# EAGLE schematic MPB-03a (EAGLE 6.0)
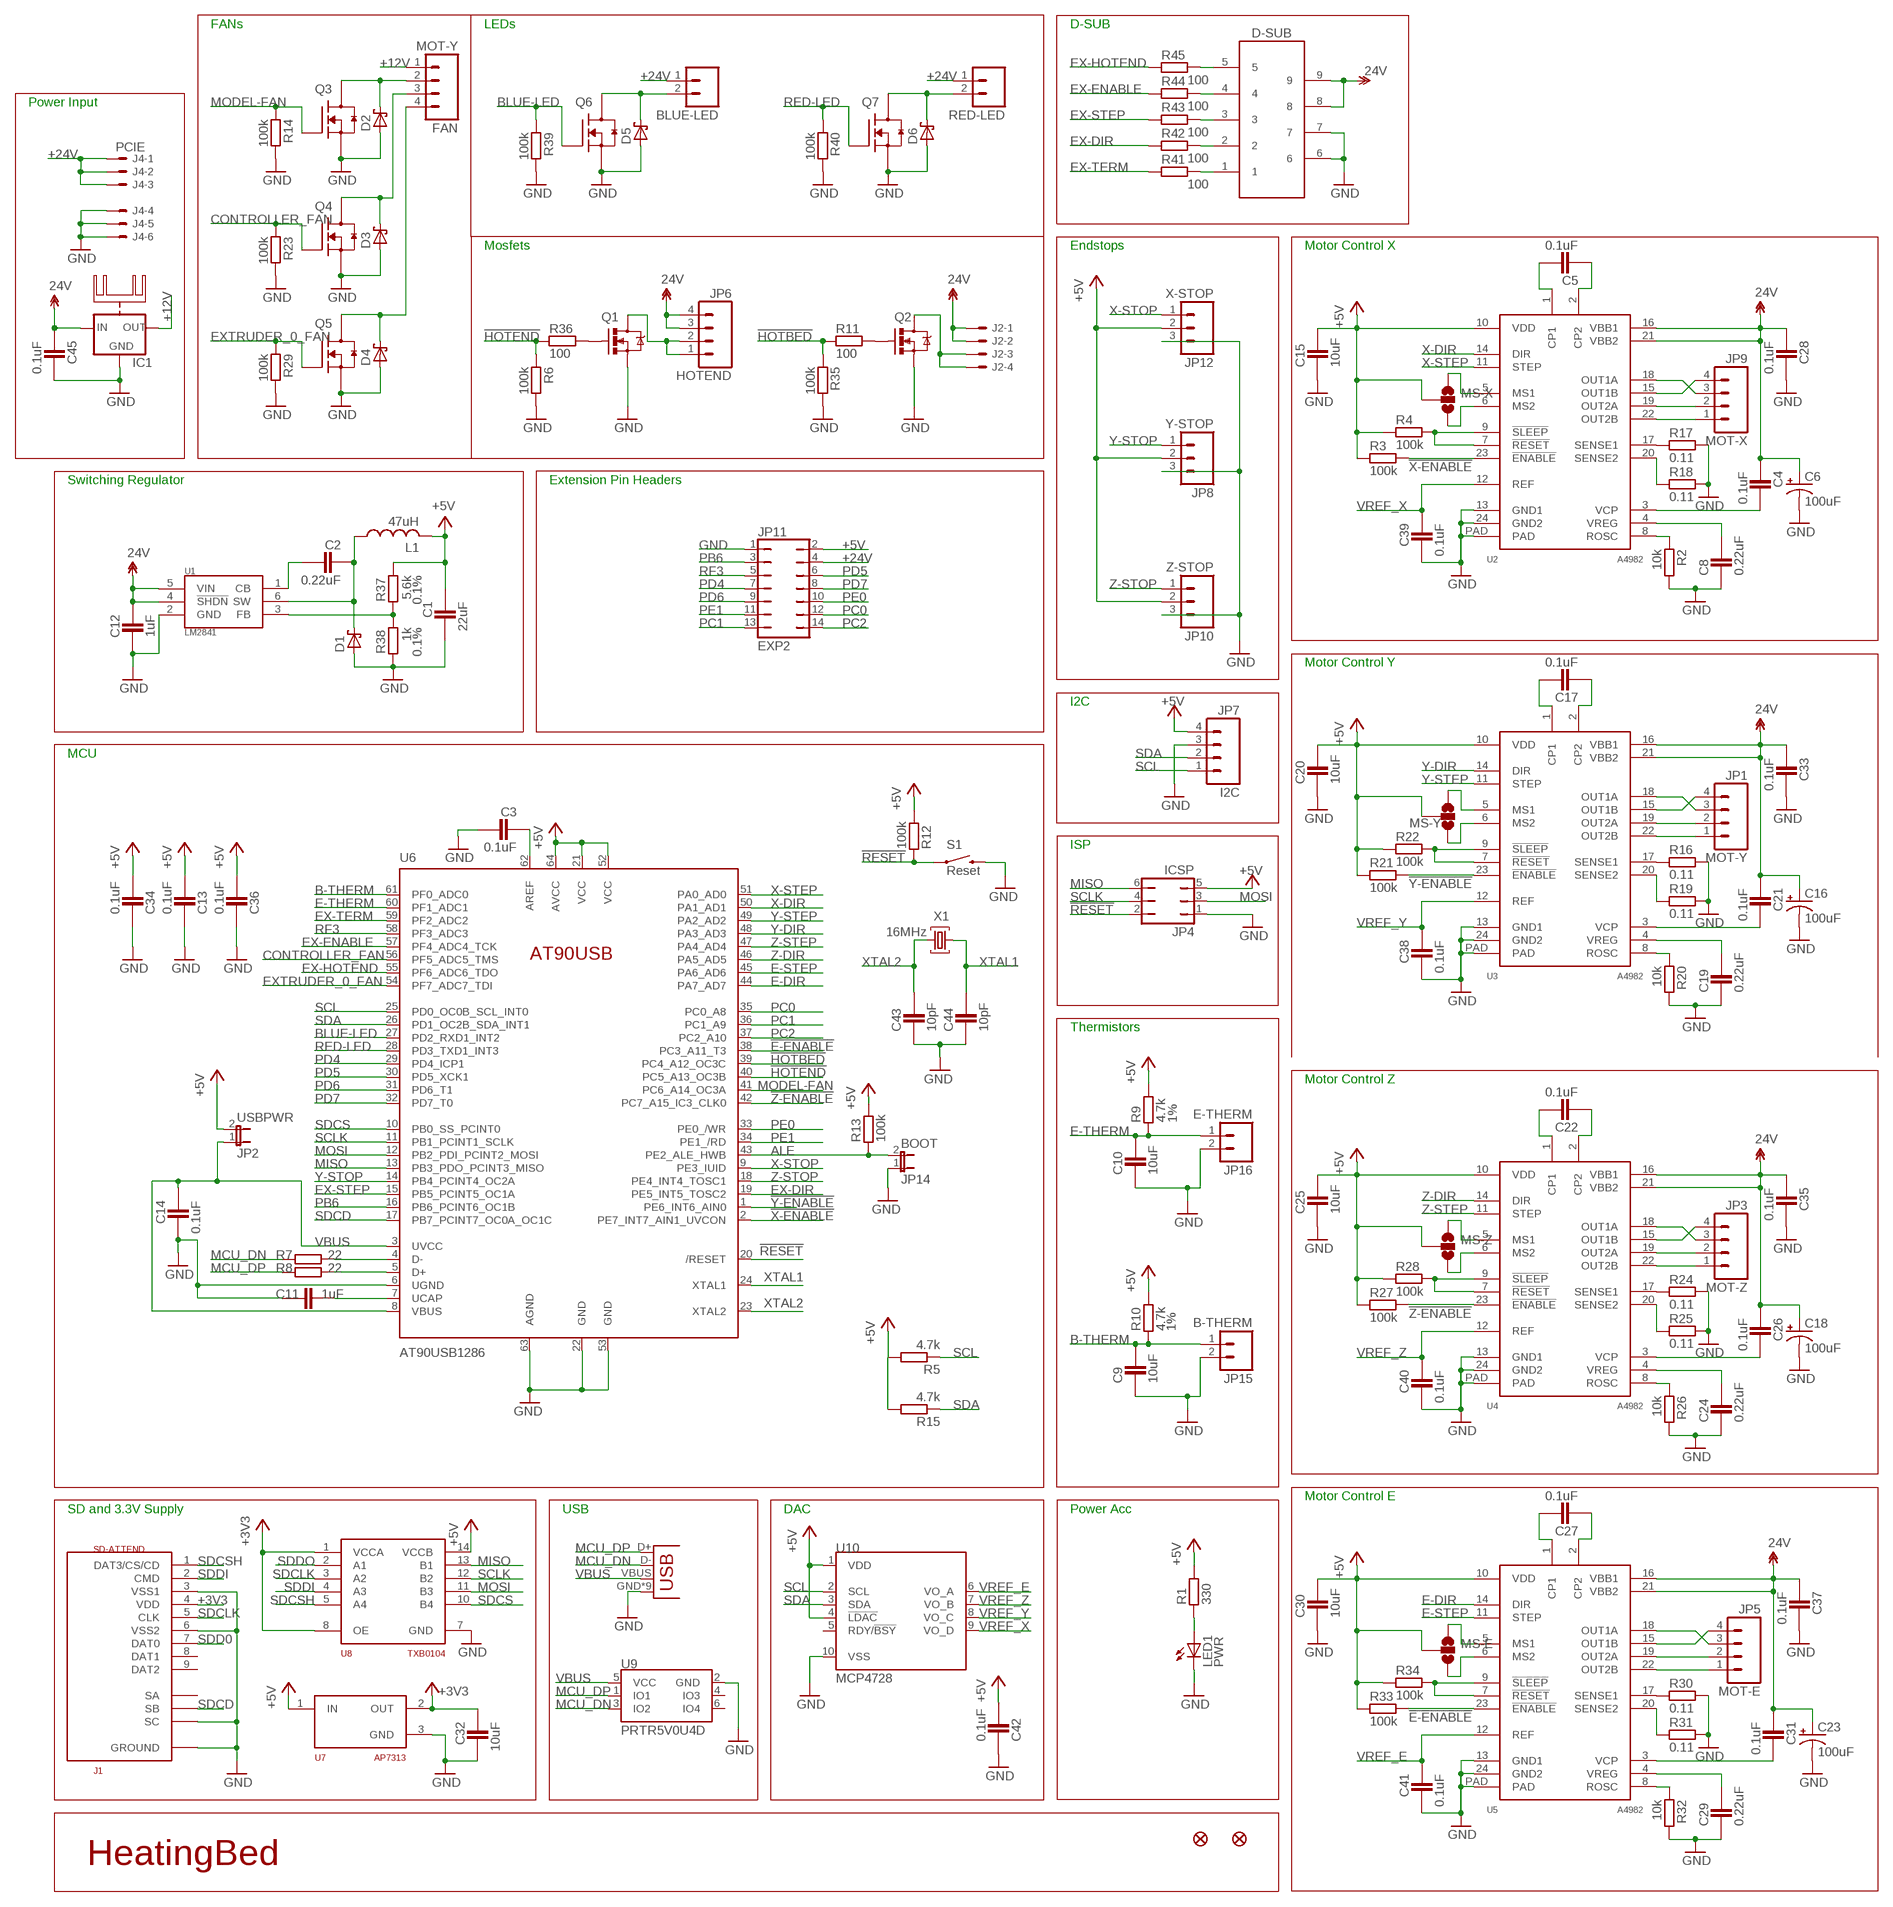
[diagram p0: schematic, sheet 1]

## Parts
BLUE-LED  M02POLAR  [MOLEX-1X2]
C1  22uF  CAPACITOR_0805  [CAPC2012X145AN]
C2  0.22uF  CAPACITOR_0805  [CAPC2012X145AN]
C3  0.1uF  CAPACITOR_0805  [CAPC2012X145AN]
C4  0.1uF  CAPACITOR_0805  [CAPC2012X145AN]
C5  0.1uF  CAPACITOR_0805  [CAPC2012X145AN]
C6  100uF  CPOL-USD  [PANASONIC_D]
C8  0.22uF  CAPACITOR_0805  [CAPC2012X145AN]
C9  10uF  CAPACITOR_0805  [CAPC2012X145AN]
C10  10uF  CAPACITOR_0805  [CAPC2012X145AN]
C11  1uF  CAPACITOR_0805  [CAPC2012X145AN]
C12  1uF  CAPACITOR_0805  [CAPC2012X145AN]
C13  0.1uF  CAPACITOR_0805  [CAPC2012X145AN]
C14  0.1uF  CAPACITOR_0805  [CAPC2012X145AN]
C15  10uF  CAPACITOR_0805  [CAPC2012X145AN]
C16  100uF  CPOL-USD  [PANASONIC_D]
C17  0.1uF  CAPACITOR_0805  [CAPC2012X145AN]
C18  100uF  CPOL-USD  [PANASONIC_D]
C19  0.22uF  CAPACITOR_0805  [CAPC2012X145AN]
C20  10uF  CAPACITOR_0805  [CAPC2012X145AN]
C21  0.1uF  CAPACITOR_0805  [CAPC2012X145AN]
C22  0.1uF  CAPACITOR_0805  [CAPC2012X145AN]
C23  100uF  CPOL-USD  [PANASONIC_D]
C24  0.22uF  CAPACITOR_0805  [CAPC2012X145AN]
C25  10uF  CAPACITOR_0805  [CAPC2012X145AN]
C26  0.1uF  CAPACITOR_0805  [CAPC2012X145AN]
C27  0.1uF  CAPACITOR_0805  [CAPC2012X145AN]
C28  0.1uF  CAPACITOR_0805  [CAPC2012X145AN]
C29  0.22uF  CAPACITOR_0805  [CAPC2012X145AN]
C30  10uF  CAPACITOR_0805  [CAPC2012X145AN]
C31  0.1uF  CAPACITOR_0805  [CAPC2012X145AN]
C32  10uF  CAPACITOR_0805  [CAPC2012X145AN]
C33  0.1uF  CAPACITOR_0805  [CAPC2012X145AN]
C34  0.1uF  CAPACITOR_0805  [CAPC2012X145AN]
C35  0.1uF  CAPACITOR_0805  [CAPC2012X145AN]
C36  0.1uF  CAPACITOR_0805  [CAPC2012X145AN]
C37  0.1uF  CAPACITOR_0805  [CAPC2012X145AN]
C38  0.1uF  CAPACITOR_0805  [CAPC2012X145AN]
C39  0.1uF  CAPACITOR_0805  [CAPC2012X145AN]
C40  0.1uF  CAPACITOR_0805  [CAPC2012X145AN]
C41  0.1uF  CAPACITOR_0805  [CAPC2012X145AN]
C42  0.1uF  CAPACITOR_0805  [CAPC2012X145AN]
C43  10pF  CAPACITOR_0805  [CAPC2012X145AN]
C44  10pF  CAPACITOR_0805  [CAPC2012X145AN]
C45  0.1uF  CAPACITOR_0805  [CAPC2012X145AN]
D1  SCH-DIODESMA  [SMA]
D2  SCH-DIODESMA  [SMA]
D3  SCH-DIODESMA  [SMA]
D4  SCH-DIODESMA  [SMA]
D5  SCH-DIODESMA  [SMA]
D6  SCH-DIODESMA  [SMA]
D-SUB  618009211721  [618009211721]
FAN  MOT-Y  M04POLAR  [MOLEX-1X4]
IC1  78XXH  [TO220-15X17X25]
J1  SD-ATTEND  [SD-ATTEND]
J2  5566-4  [5566-4]
J3  USB-MICRO-PTH  [USB-MICROB-PTH]
J4  PCIE  5566-6  [5566-6]
JP1  MOT-Y  M04POLAR  [MOLEX-1X4]
JP2  USBPWR  JUMPER-2PTH  [1X02]
JP3  MOT-Z  M04POLAR  [MOLEX-1X4]
JP4  ICSP  JP3Q  [JP3Q]
JP5  MOT-E  M04POLAR  [MOLEX-1X4]
JP6  HOTEND  M04POLAR  [MOLEX-1X4]
JP7  I2C  M04POLAR  [MOLEX-1X4]
JP8  Y-STOP  M03POLAR  [MOLEX-1X3]
JP9  MOT-X  M04POLAR  [MOLEX-1X4]
JP10  Z-STOP  M03POLAR  [MOLEX-1X3]
JP11  EXP2  JP7Q  [JP7Q]
JP12  X-STOP  M03POLAR  [MOLEX-1X3]
JP14  BOOT  JUMPER-2PTH  [1X02]
JP15  B-THERM  M02PTH  [1X02]
JP16  E-THERM  M02PTH  [1X02]
JP26  FIDUCIAL1X2.5  [FIDUCIAL-1X2.5]
JP33  FIDUCIAL1X2.5  [FIDUCIAL-1X2.5]
L1  47uH  L-US  [SDR1006]
LED1  PWR  LEDCHIP-LED0805  [CHIP-LED0805]
MS-E  SOLDERJUMPER_2WAYCONNECTED  [SJ_3_CONNECTED]
MS-X  SOLDERJUMPER_2WAYCONNECTED  [SJ_3_CONNECTED]
MS-Y  SOLDERJUMPER_2WAYCONNECTED  [SJ_3_CONNECTED]
MS-Z  SOLDERJUMPER_2WAYCONNECTED  [SJ_3_CONNECTED]
Q1  RFP30N06LE  MOSFET-NCHANNELPTH2  [TO220V]
Q2  RFP30N06LE  MOSFET-NCHANNELPTH2  [TO220V]
Q3  RFP30N06LE  MOSFET-NCH_SOT-23  [SOT95P280X135-3N]
Q4  RFP30N06LE  MOSFET-NCH_SOT-23  [SOT95P280X135-3N]
Q5  RFP30N06LE  MOSFET-NCH_SOT-23  [SOT95P280X135-3N]
Q6  RFP30N06LE  MOSFET-NCH_SOT-23  [SOT95P280X135-3N]
Q7  RFP30N06LE  MOSFET-NCH_SOT-23  [SOT95P280X135-3N]
R1  330  RESISTOR_0805  [RESC2012X70N]
R2  10k  RESISTOR_0805  [RESC2012X70N]
R3  100k  RESISTOR_0805  [RESC2012X70N]
R4  100k  RESISTOR_0805  [RESC2012X70N]
R5  4.7k  RESISTOR_0805  [RESC2012X70N]
R6  100k  RESISTOR_0805  [RESC2012X70N]
R7  22  RESISTOR_0805  [RESC2012X70N]
R8  22  RESISTOR_0805  [RESC2012X70N]
R9  4.7k  RESISTOR_0805  [RESC2012X70N]
R10  4.7k  RESISTOR_0805  [RESC2012X70N]
R11  100  RESISTOR_0805  [RESC2012X70N]
R12  100k  RESISTOR_0805  [RESC2012X70N]
R13  100k  RESISTOR_0805  [RESC2012X70N]
R14  100k  RESISTOR_0805  [RESC2012X70N]
R15  4.7k  RESISTOR_0805  [RESC2012X70N]
R16  0.11  RESISTOR_0805  [RESC2012X70N]
R17  0.11  RESISTOR_0805  [RESC2012X70N]
R18  0.11  RESISTOR_0805  [RESC2012X70N]
R19  0.11  RESISTOR_0805  [RESC2012X70N]
R20  10k  RESISTOR_0805  [RESC2012X70N]
R21  100k  RESISTOR_0805  [RESC2012X70N]
R22  100k  RESISTOR_0805  [RESC2012X70N]
R23  100k  RESISTOR_0805  [RESC2012X70N]
R24  0.11  RESISTOR_0805  [RESC2012X70N]
R25  0.11  RESISTOR_0805  [RESC2012X70N]
R26  10k  RESISTOR_0805  [RESC2012X70N]
R27  100k  RESISTOR_0805  [RESC2012X70N]
R28  100k  RESISTOR_0805  [RESC2012X70N]
R29  100k  RESISTOR_0805  [RESC2012X70N]
R30  0.11  RESISTOR_0805  [RESC2012X70N]
R31  0.11  RESISTOR_0805  [RESC2012X70N]
R32  10k  RESISTOR_0805  [RESC2012X70N]
R33  100k  RESISTOR_0805  [RESC2012X70N]
R34  100k  RESISTOR_0805  [RESC2012X70N]
R35  100k  RESISTOR_0805  [RESC2012X70N]
R36  100  RESISTOR_0805  [RESC2012X70N]
R37  5.6k  RESISTOR_0805  [RESC2012X70N]
R38  1k  RESISTOR_0805  [RESC2012X70N]
R39  100k  RESISTOR_0805  [RESC2012X70N]
R40  100k  RESISTOR_0805  [RESC2012X70N]
R41  100  RESISTOR_0805  [RESC2012X70N]
R42  100  RESISTOR_0805  [RESC2012X70N]
R43  100  RESISTOR_0805  [RESC2012X70N]
R44  100  RESISTOR_0805  [RESC2012X70N]
R45  100  RESISTOR_0805  [RESC2012X70N]
RED-LED  M02POLAR  [MOLEX-1X2]
S1  Reset  SWITCH-MOMENTARY-2  [TACTILE_SWITCH_TALL]
U1  LM2841  [TSOT6]
U2  A4982  [TSSOP-24]
U3  A4982  [TSSOP-24]
U4  A4982  [TSSOP-24]
U5  A4982  [TSSOP-24]
U6  AT90USB1286  AT90USB  [TQFP64-2]
U7  AP7313  [SOT23C]
U8  TXB0104  [TSSOP14]
U9  PRTR5V0U4D  [SOT23-6]
U10  MCP4728  [MSOP10]
X1  16MHz  XTAL  [NDK-XTAL]

## Nets
!E-ENABLE: R33.2 U5.23(!ENABLE) U6.38(PC3_A11_T3)
!HOTBED: R11.1 R35.1 U6.39(PC4_A12_OC3C)
!HOTEND: R6.1 R36.1 U6.40(PC5_A13_OC3B)
!RESET: JP4.2 R12.1 S1.A2 U6.20(/RESET)
!X-ENABLE: R3.2 U2.23(!ENABLE) U6.2(PE7_INT7_AIN1_UVCON)
!Y-ENABLE: R21.2 U3.23(!ENABLE) U6.1(PE6_INT6_AIN0)
!Z-ENABLE: R27.2 U4.23(!ENABLE) U6.42(PC7_A15_IC3_CLK0)
+3V3 [power]: C32.1 J1.4(VDD) U7.2(OUT) U8.1(VCCA) U8.8(OE)
+5V [power]: C1.1 C13.2 C15.2 C20.2 C25.2 C30.2 C34.2 C36.2 C42.2 JP2.2 JP4.5 JP7.4 JP8.2 JP10.2 JP11.2 JP12.2 L1.P$2 MS-E.2 MS-X.2 MS-Y.2 MS-Z.2 R1.2 R3.1 R4.1 R5.2 R9.2 R10.2 R12.2 R13.2 R15.2 R21.1 R22.1 R27.1 R28.1 R33.1 R34.1 R37.1 U2.10(VDD) U3.10(VDD) U4.10(VDD) U5.10(VDD) U6.21(VCC) U6.52(VCC) U6.64(AVCC) U7.1(IN) U8.14(VCCB) U10.1(VDD) U10.4(!LDAC)
+12V: FAN.1 IC1.OUT
+24V: BLUE-LED.1 C4.1 C6.+ C12.1 C16.+ C18.+ C21.1 C23.+ C26.1 C28.1 C31.1 C33.1 C35.1 C37.1 C45.1 D-SUB.8 D-SUB.9 IC1.IN J2.1 J2.2 J4.1 J4.2 J4.3 JP6.3 JP6.4 JP11.4 RED-LED.1 U1.4(!SHDN) U1.5(VIN) U2.16(VBB1) U2.21(VBB2) U3.16(VBB1) U3.21(VBB2) U4.16(VBB1) U4.21(VBB2) U5.16(VBB1) U5.21(VBB2) ; supply symbol labelled 24V
ALE: JP14.2 R13.1 U6.43(PE2_ALE_HWB)
AREF: C3.1 U6.62(AREF)
B-THERM: C9.2 JP15.1 R10.1 U6.61(PF0_ADC0)
BLUE-LED: Q6.1(G) R39.1 U6.27(PD2_RXD1_INT2)
CONTROLLER_FAN: Q4.1(G) R23.1 U6.56(PF5_ADC5_TMS)
E-DIR: U5.14(DIR) U6.44(PA7_AD7)
E-STEP: U5.11(STEP) U6.45(PA6_AD6)
E-THERM: C10.2 JP16.1 R9.1 U6.60(PF1_ADC1)
EX-DIR: R42.1 U6.19(PE5_INT5_TOSC2)
EX-ENABLE: R44.1 U6.57(PF4_ADC4_TCK)
EX-HOTEND: R45.1 U6.55(PF6_ADC6_TDO)
EX-STEP: R43.1 U6.15(PB5_PCINT5_OC1A)
EX-TERM: R41.1 U6.59(PF2_ADC2)
EXTRUDER_0_FAN: Q5.1(G) R29.1 U6.54(PF7_ADC7_TDI)
GND [power]: C1.2 C3.2 C6.- C8.1 C9.1 C10.1 C11.1 C12.2 C13.1 C14.2 C15.1 C16.- C18.- C19.1 C20.1 C23.- C24.1 C25.1 C28.2 C29.1 C30.1 C32.2 C33.2 C34.1 C35.2 C36.1 C37.2 C38.2 C39.2 C40.2 C41.2 C42.1 C43.1 C44.1 C45.2 D1.A D2.A D3.A D4.A D5.A D6.A D-SUB.6 D-SUB.7 IC1.GND J1.3(VSS1) J1.6(VSS2) J1.G(GROUND) J1.SC J3.GND J3.GND1(GND) J3.GND2(GND) J3.GND3(GND) J3.GND4(GND) J3.GND5(GND) J3.GND6(GND) J3.GND7(GND) J3.GND8(GND) J4.4 J4.5 J4.6 JP4.1 JP7.3 JP8.3 JP10.3 JP11.1 JP12.3 JP14.1 JP15.2 JP16.2 LED1.C Q1.3(S) Q2.3(S) Q3.2(S) Q4.2(S) Q5.2(S) Q6.2(S) Q7.2(S) R2.2 R6.2 R14.2 R16.2 R17.2 R18.2 R19.2 R20.2 R23.2 R24.2 R25.2 R26.2 R29.2 R30.2 R31.2 R32.2 R35.2 R38.2 R39.2 R40.2 S1.B2 U1.2(GND) U2.13(GND1) U2.24(GND2) U2.PAD U3.13(GND1) U3.24(GND2) U3.PAD U4.13(GND1) U4.24(GND2) U4.PAD U5.13(GND1) U5.24(GND2) U5.PAD U6.6(UGND) U6.22(GND) U6.53(GND) U6.63(AGND) U7.3(GND) U8.7(GND) U9.2(GND) U10.10(VSS)
HOTBED-GND [power]: J2.3 J2.4 Q2.2(D)
HOTEND-GND [power]: JP6.1 JP6.2 Q1.2(D)
MCU_DN: J3.D- R7.1 U9.3(IO2)
MCU_DP: J3.D+ R8.1 U9.1(IO1)
MISO: JP4.6 U6.13(PB3_PDO_PCINT3_MISO) U8.13(B1)
MODEL-FAN: Q3.1(G) R14.1 U6.41(PC6_A14_OC3A)
MOSI: JP4.3 U6.12(PB2_PDI_PCINT2_MOSI) U8.11(B3)
N$1: LED1.A R1.1
N$2: D2.C FAN.2 Q3.3(D)
N$3: R7.2 U6.4(D-)
N$4: R8.2 U6.5(D+)
N$5: D3.C FAN.3 Q4.3(D)
N$6: D4.C FAN.4 Q5.3(D)
N$7: Q2.1(G) R11.2
N$8: BLUE-LED.2 D5.C Q6.3(D)
N$9: C11.2 U6.7(UCAP)
N$10: JP9.3 U2.18(OUT1A)
N$11: C5.2 U2.1(CP1)
N$12: C5.1 U2.2(CP2)
N$13: R2.1 U2.8(ROSC)
N$14: R17.1 U2.17(SENSE1)
N$15: R18.1 U2.20(SENSE2)
N$16: C4.2 U2.3(VCP)
N$17: JP9.4 U2.15(OUT1B)
N$18: D-SUB.5 R45.2
N$19: C8.2 U2.4(VREG)
N$20: JP9.2 U2.19(OUT2A)
N$21: R4.2 U2.7(!RESET) U2.9(!SLEEP)
N$22: R37.2 R38.1 U1.3(FB)
N$23: JP9.1 U2.22(OUT2B)
N$24: JP1.2 U3.19(OUT2A)
N$25: JP1.1 U3.22(OUT2B)
N$26: JP1.4 U3.15(OUT1B)
N$27: MS-X.1 U2.5(MS1)
N$28: MS-X.3 U2.6(MS2)
N$29: C17.2 U3.1(CP1)
N$30: C17.1 U3.2(CP2)
N$31: JP1.3 U3.18(OUT1A)
N$32: R19.1 U3.20(SENSE2)
N$33: D6.C Q7.3(D) RED-LED.2
N$34: R20.1 U3.8(ROSC)
N$35: C19.2 U3.4(VREG)
N$36: R22.2 U3.7(!RESET) U3.9(!SLEEP)
N$37: C21.2 U3.3(VCP)
N$38: R16.1 U3.17(SENSE1)
N$39: JP3.4 U4.15(OUT1B)
N$40: JP3.3 U4.18(OUT1A)
N$41: JP3.2 U4.19(OUT2A)
N$42: MS-Y.1 U3.5(MS1)
N$43: MS-Y.3 U3.6(MS2)
N$44: C22.2 U4.1(CP1)
N$45: C22.1 U4.2(CP2)
N$46: R24.1 U4.17(SENSE1)
N$47: R25.1 U4.20(SENSE2)
N$49: R26.1 U4.8(ROSC)
N$50: C24.2 U4.4(VREG)
N$51: R28.2 U4.7(!RESET) U4.9(!SLEEP)
N$52: C26.2 U4.3(VCP)
N$53: JP3.1 U4.22(OUT2B)
N$54: JP5.4 U5.15(OUT1B)
N$55: JP5.3 U5.18(OUT1A)
N$56: JP5.2 U5.19(OUT2A)
N$57: MS-Z.1 U4.5(MS1)
N$58: MS-Z.3 U4.6(MS2)
N$59: C27.2 U5.1(CP1)
N$60: C27.1 U5.2(CP2)
N$61: R30.1 U5.17(SENSE1)
N$62: R31.1 U5.20(SENSE2)
N$63: D-SUB.4 R44.2
N$64: R32.1 U5.8(ROSC)
N$65: C29.2 U5.4(VREG)
N$66: R34.2 U5.7(!RESET) U5.9(!SLEEP)
N$67: C31.2 U5.3(VCP)
N$68: JP5.1 U5.22(OUT2B)
N$69: D-SUB.3 R43.2
N$70: D-SUB.2 R42.2
N$71: Q1.1(G) R36.2
N$72: MS-E.1 U5.5(MS1)
N$73: MS-E.3 U5.6(MS2)
N$74: D-SUB.1 R41.2
N$75: C2.1 D1.C L1.P$1 U1.6(SW)
N$77: C2.2 U1.1(CB)
PB6: JP11.3 U6.16(PB6_PCINT6_OC1B)
PC0: JP11.12 U6.35(PC0_A8)
PC1: JP11.13 U6.36(PC1_A9)
PC2: JP11.14 U6.37(PC2_A10)
PD4: JP11.7 U6.29(PD4_ICP1)
PD5: JP11.6 U6.30(PD5_XCK1)
PD6: JP11.9 U6.31(PD6_T1)
PD7: JP11.8 U6.32(PD7_T0)
PE0: JP11.10 U6.33(PE0_/WR)
PE1: JP11.11 U6.34(PE1_/RD)
RED-LED: Q7.1(G) R40.1 U6.28(PD3_TXD1_INT3)
RF3: JP11.5 U6.58(PF3_ADC3)
SCL [power]: JP7.1 R5.1 U6.25(PD0_OC0B_SCL_INT0) U10.2(SCL)
SCLK: JP4.4 U6.11(PB1_PCINT1_SCLK) U8.12(B2)
SDA [power]: JP7.2 R15.1 U6.26(PD1_OC2B_SDA_INT1) U10.3(SDA)
SDCD: J1.SB U6.17(PB7_PCINT7_OC0A_OC1C)
SDCLK: J1.5(CLK) U8.3(A2)
SDCS: U6.10(PB0_SS_PCINT0) U8.10(B4)
SDCSH: J1.1(DAT3/CS/CD) U8.5(A4)
SDD0: J1.7(DAT0)
SDDI: J1.2(CMD) U8.4(A3)
SDDO: U8.2(A1)
VBUS: C14.1 J3.VBUS JP2.1 U6.3(UVCC) U6.8(VBUS) U9.5(VCC)
VREF_E: C41.1 U5.12(REF) U10.6(VO_A)
VREF_X: C39.1 U2.12(REF) U10.9(VO_D)
VREF_Y: C38.1 U3.12(REF) U10.8(VO_C)
VREF_Z: C40.1 U4.12(REF) U10.7(VO_B)
X-DIR: U2.14(DIR) U6.50(PA1_AD1)
X-STEP: U2.11(STEP) U6.51(PA0_AD0)
X-STOP: JP12.1 U6.9(PE3_IUID)
XTAL1: C44.2 U6.24(XTAL1) X1.P$1
XTAL2: C43.2 U6.23(XTAL2) X1.P$2
Y-DIR: U3.14(DIR) U6.48(PA3_AD3)
Y-STEP: U3.11(STEP) U6.49(PA2_AD2)
Y-STOP: JP8.1 U6.14(PB4_PCINT4_OC2A)
Z-DIR: U4.14(DIR) U6.46(PA5_AD5)
Z-STEP: U4.11(STEP) U6.47(PA4_AD4)
Z-STOP: JP10.1 U6.18(PE4_INT4_TOSC1)
Unconnected: J1.8(DAT1) J1.9(DAT2) J1.SA U9.4(IO3) U9.6(IO4) U10.5(RDY/!BSY)

## Notes on the sheet
- FANs | LEDs | D-SUB
- Power Input
- Mosfets | Endstops | Motor Control X
- Switching Regulator | Extension Pin Headers
- Motor Control Y
- I2C
- MCU
- ISP
- Thermistors
- Motor Control Z
- Motor Control E
- SD and 3.3V Supply | USB | DAC | Power Acc
- HeatingBed

## Library data of the parts
BLUE-LED JP15 JP16 RED-LED = SparkFun:M02: Header 2 Standard 2-pin 0.1" header. Use with straight break away headers (SKU : PRT-00116), right angle break away headers (PRT-00553), swiss pins (PRT-00743), machine pins (PRT-00117), and female headers (PRT-00115). Molex polarized connector foot print use with SKU : PRT-08233 with associated crimp pins and housings.
C1-C5 C8-C15 C17 C19-C22 C24-C45 = ipc-7351-capacitor:CAPACITOR_
C6 C16 C18 C23 = rcl:CPOL-US: POLARIZED CAPACITOR, American symbol
D1-D6 = printrbot:SCH-DIODE: Schottky Diodes Source: Fairchild .. BAT54.pdf
D-SUB = D-SUB_Connectors:618009211721: WR-DSUB 8.08mm Male Angled PCB Connector without Hex Screw, 9 pins
FAN JP1 JP3 JP5-JP7 JP9 = SparkFun:M04: Header 4 Standard 4-pin 0.1" header. Use with straight break away headers (SKU : PRT-00116), right angle break away headers (PRT-00553), swiss pins (PRT-00743), machine pins (PRT-00117), and female headers (PRT-00115). Molex polarized connector foot print use with SKU : PRT-08231 with associated crimp pins and housings. 1MM SMD Version SKU: PRT-10208
IC1 = 78xx_with_heatsink:78XXH: VOLTAGE REGULATOR
J1 = printrbot:SD-ATTEND
J2 = printrbot:5566-4: Mini FIT connector 4 pol Source: http://www.molex.com; OC_FARNELL: unknown; OC_NEWARK: unknown
J3 = printrbot:USB: USB Connectors USB-B-PTH is fully proven SKU : PRT-00139 USB-miniB is fully proven SKU : PRT-00587 USB-A-PCB is untested. USB-A-H is throughly reviewed, but untested. Spark Fun Electronics SKU : PRT-00437 USB-B-SMT is throughly reviewed, but untested. Needs silkscreen touching up. USB-A-S has not been used/tested USB-MB-H has not been used/tested
J4 = printrbot:5566-6: Mini FIT connector 6 pol Source: http://www.molex.com; MPN: 95566-61002; OC_FARNELL: unknown; OC_NEWARK: 22K8620
JP2 JP14 = SparkFun:JUMPER-2: Jumper Basic 0.1" spaced jumper. Use with breakaway headers.
JP4 = printrbot:JP3Q: JUMPER
JP8 JP10 JP12 = SparkFun:M03: Header 3 Standard 3-pin 0.1" header. Use with straight break away headers (SKU : PRT-00116), right angle break away headers (PRT-00553), swiss pins (PRT-00743), machine pins (PRT-00117), and female headers (PRT-00115). Molex polarized connector foot print use with SKU : PRT-08232 with associated crimp pins and housings.
JP11 = printrbot:JP7Q: JUMPER
JP26 JP33 = SparkFun:FIDUCIAL: Fiducial Alignment Points Various fiducial points for machine vision alignment.
L1 = printrbot:L-US
LED1 = led:LED: LED OSRAM: - CHIPLED LG R971, LG N971, LY N971, LG Q971, LY Q971, LO R971, LY R971 LH N974, LH R974 LS Q976, LO Q976, LY Q976 LO Q996 - Hyper CHIPLED LW Q18S LB Q993, LB Q99A, LB R99A - SideLED LS A670, LO A670, LY A670, LG A670, LP A670 LB A673, LV A673, LT A673, LW A673 LH A674 LY A675 LS A676, LA A676, LO A676, LY A676, LW A676 LS A679, LY A679, LG A679 - Hyper Micro SIDELED® LS Y876, LA Y876, LO Y876, LY Y876 LT Y87S - SmartLED LW L88C, LW L88S LB L89C, LB L89S, LG L890 LS L89K, LO L89K, LY L89K LS L896, LA L896, LO L896, LY L896 - TOPLED LS T670, LO T670, LY T670, LG T670, LP T670 LSG T670, LSP T670, LSY T670, LOP T670, LYG T670 LG T671, LOG T671, LSG T671 LB T673, LV T673, LT T673, LW T673 LH T674 LS T676, LA T676, LO T676, LY T676, LB T676, LH T676, LSB T676, LW T676 LB T67C, LV T67C, LT T67C, LS T67K, LO T67K, LY T67K, LW E67C LS E67B, LA E67B, LO E67B, LY E67B, LB E67C, LV E67C, LT E67C LW T67C LS T679, LY T679, LG T679 LS T770, LO T770, LY T770, LG T770, LP T770 LB T773, LV T773, LT T773, LW T773 LH T774 LS E675, LA E675, LY E675, LS T675 LS T776, LA T776, LO T776, LY T776, LB T776 LHGB T686 LT T68C, LB T68C - Hyper Mini TOPLED® LB M676 - Mini TOPLED Santana® LG M470 LS M47K, LO M47K, LY M47K Source: http://www.osram.convergy.de LUXEON: - LUMILED® LXK2-PW12-R00, LXK2-PW12-S00, LXK2-PW14-U00, LXK2-PW14-V00 LXK2-PM12-R00, LXK2-PM12-S00, LXK2-PM14-U00 LXK2-PE12-Q00, LXK2-PE12-R00, LXK2-PE12-S00, LXK2-PE14-T00, LXK2-PE14-U00 LXK2-PB12-K00, LXK2-PB12-L00, LXK2-PB12-M00, LXK2-PB14-N00, LXK2-PB14-P00, LXK2-PB14-Q00 LXK2-PR12-L00, LXK2-PR12-M00, LXK2-PR14-Q00, LXK2-PR14-R00 LXK2-PD12-Q00, LXK2-PD12-R00, LXK2-PD12-S00 LXK2-PH12-R00, LXK2-PH12-S00 LXK2-PL12-P00, LXK2-PL12-Q00, LXK2-PL12-R00 Source: www.luxeon.com KINGBRIGHT: KA-3528ASYC Source: www.kingbright.com
MS-E MS-X MS-Y MS-Z = printrbot:SOLDERJUMPER_2WAY: Solder Jumper 2 way solder jumper
Q1 Q2 = SparkFun:MOSFET-NCHANNEL
Q3-Q7 = ipc-7351-transistor:MOSFET-NCH_
R1-R8 R11-R36 R39-R45 = ipc-7351-resistor:RESISTOR_
R9 R10 = ipc-7351-resistor:RESISTOR_; TOLERANCE: 1%
R37 R38 = ipc-7351-resistor:RESISTOR_; TOLERANCE: 0.1%
S1 = printrbot:SWITCH-MOMENTARY-2
U1 = printrbot:LM2841
U2-U5 = printrbot:A4982
U6 = Atmel-at90usb-teensy:AT90USB
U7 = printrbot:AP7313
U8 = printrbot:TXB0104
U9 = printrbot:PRTR5V0U4D
U10 = printrbot:MCP4728
X1 = printrbot:XTAL